# Altium schematic sheet Kajtuś-DSP_block_diagram.SchDoc: Kajtuś-DSP
size A4; DocumentNumber: 1; SheetNumber: 1; SheetTotal: 9
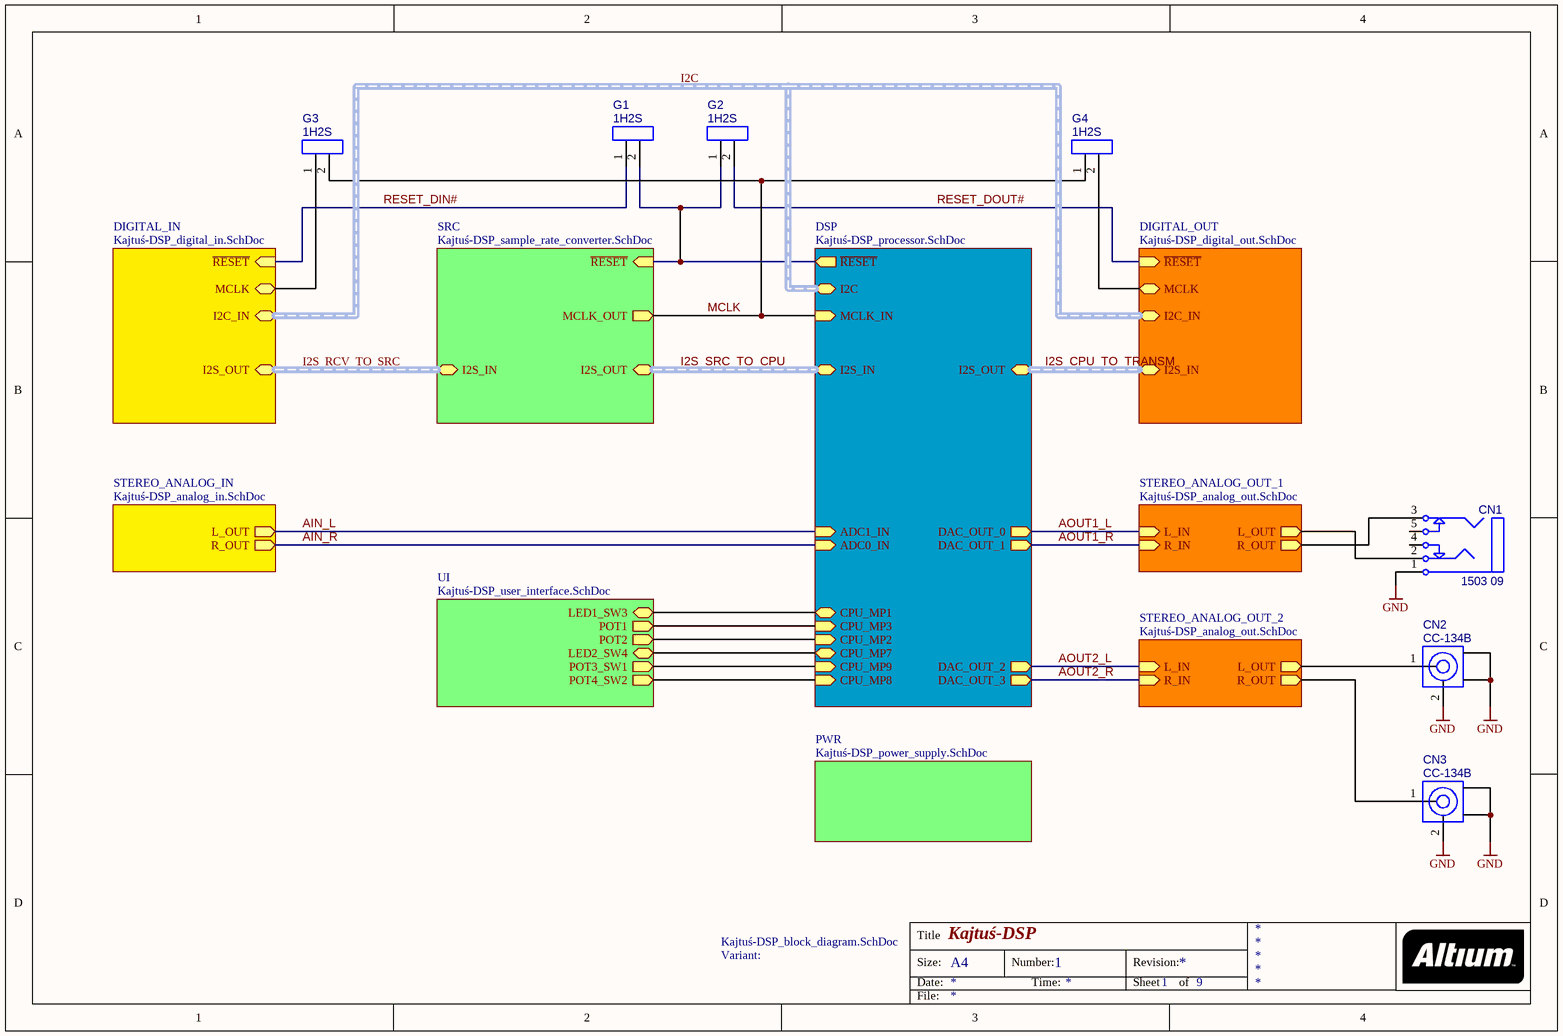
[diagram p0: Kajtuś-DSP_block_diagram.SchDoc]

## Parts
CN1  1503 09  [CN_JACK_3.5_STEREO_1503-09]
CN2  CC-134B  [CN_RCA_CC-134x]
CN3  CC-134B  [CN_RCA_CC-134x]
G1  value 1H2S  [1H2S_FHS]  (hidden comment: G_1H2S)
G2  value 1H2S  [1H2S_FHS]  (hidden comment: G_1H2S)
G3  value 1H2S  [1H2S_FHS]  (hidden comment: G_1H2S)
G4  value 1H2S  [1H2S_FHS]  (hidden comment: G_1H2S)

## Sub-sheets
DIGITAL_IN = Kajtuś-DSP_digital_in.SchDoc: ~{RESET} (in), I2S_OUT (harness I2S), I2C_IN (harness I2C), MCLK
DIGITAL_OUT = Kajtuś-DSP_digital_out.SchDoc: ~{RESET} (in), I2S_IN (harness I2S), I2C_IN (harness I2C), MCLK
DSP = Kajtuś-DSP_processor.SchDoc: I2S_IN (harness I2S), ~{RESET} (out), DAC_OUT_0 (out), DAC_OUT_1 (out), DAC_OUT_2 (out), DAC_OUT_3 (out), ADC0_IN (in), ADC1_IN (in), CPU_MP1, CPU_MP2 (in), CPU_MP3 (in), CPU_MP7, CPU_MP8 (in), CPU_MP9 (in), I2S_OUT (harness I2S), I2C (harness I2C), MCLK_IN (in)
PWR = Kajtuś-DSP_power_supply.SchDoc: no entries
SRC = Kajtuś-DSP_sample_rate_converter.SchDoc: I2S_IN (harness I2S), I2S_OUT (harness I2S), ~{RESET} (in), MCLK_OUT (out)
STEREO_ANALOG_IN = Kajtuś-DSP_analog_in.SchDoc: L_OUT (out), R_OUT (out)
STEREO_ANALOG_OUT_1 = Kajtuś-DSP_analog_out.SchDoc: L_IN (in), R_IN (in), L_OUT (out), R_OUT (out)
STEREO_ANALOG_OUT_2 = Kajtuś-DSP_analog_out.SchDoc: L_IN (in), R_IN (in), L_OUT (out), R_OUT (out)
UI = Kajtuś-DSP_user_interface.SchDoc: POT1 (out), POT2 (out), POT3_SW1 (out), POT4_SW2 (out), LED1_SW3, LED2_SW4

## Nets
GND: CN1.1 CN2.2 CN2.SH1 CN2.SH2 CN3.2 CN3.SH1 CN3.SH2
AIN_L: sheet DSP/ADC1_IN, sheet STEREO_ANALOG_IN/L_OUT
AIN_R: sheet DSP/ADC0_IN, sheet STEREO_ANALOG_IN/R_OUT
AOUT1_L: sheet DSP/DAC_OUT_0, sheet STEREO_ANALOG_OUT_1/L_IN
AOUT1_R: sheet DSP/DAC_OUT_1, sheet STEREO_ANALOG_OUT_1/R_IN
AOUT2_L: sheet DSP/DAC_OUT_2, sheet STEREO_ANALOG_OUT_2/L_IN
AOUT2_R: sheet DSP/DAC_OUT_3, sheet STEREO_ANALOG_OUT_2/R_IN
MCLK: G3.2 G4.1 ; sheet SRC/MCLK_OUT, sheet DSP/MCLK_IN
RESET_DIN#: G1.1 ; sheet DIGITAL_IN/~{RESET}
RESET_DOUT#: G2.2 ; sheet DIGITAL_OUT/~{RESET}
NetCN1_2: CN1.2 ; sheet STEREO_ANALOG_OUT_1/L_OUT
NetCN1_3: CN1.3 ; sheet STEREO_ANALOG_OUT_1/R_OUT
NetCN2_1: CN2.1 ; sheet STEREO_ANALOG_OUT_2/L_OUT
NetCN3_1: CN3.1 ; sheet STEREO_ANALOG_OUT_2/R_OUT
NetG1_2: G1.2 G2.1 ; sheet SRC/~{RESET}, sheet DSP/~{RESET}
NetG3_1: G3.1 ; sheet DIGITAL_IN/MCLK
NetG4_2: G4.2 ; sheet DIGITAL_OUT/MCLK
(unnamed): sheet DSP/CPU_MP1, sheet UI/LED1_SW3
(unnamed): sheet DSP/CPU_MP2, sheet UI/POT2
(unnamed): sheet DSP/CPU_MP3, sheet UI/POT1
(unnamed): sheet DSP/CPU_MP7, sheet UI/LED2_SW4
(unnamed): sheet DSP/CPU_MP8, sheet UI/POT4_SW2
(unnamed): sheet DSP/CPU_MP9, sheet UI/POT3_SW1

Not connected (* = marked no-connect by the designer): CN1 4 5

## Buses and harness runs
harness I2C = sheet DIGITAL_IN/I2C_IN = sheet DIGITAL_OUT/I2C_IN = sheet DSP/I2C
harness I2S_CPU_TO_TRANSM = sheet DIGITAL_OUT/I2S_IN = sheet DSP/I2S_OUT
harness I2S_RCV_TO_SRC = sheet DIGITAL_IN/I2S_OUT = sheet SRC/I2S_IN
harness I2S_SRC_TO_CPU = sheet DSP/I2S_IN = sheet SRC/I2S_OUT

## Notes on the sheet
- Variant:
- Title
- Size:
- Date:
- A4
- Number:
- Time:
- Revision:
- Sheet
- of
- File:

## Library data of the parts
CN1 = CN_JACK_3.5_STEREO_1503-09: 3-Conductor Jack with 2 break contacts (normals) and 2 auxiliary make contacts; Manufacturer: Lumberg; Vendor: TME; Part Number: 1503 09
CN2 CN3 = CN_RCA_CC-134B: Gniazdo RCA, żeńskie, ekranowane, kątowe 90°; do druku, THT, niklowane; Manufacturer: ??; Vendor: TME; Part Number: CN_RCA_CC-134B; Vendor Part Number: CC-134B; Manufacturer Part Number: CC-134B; Value: CC-134B
G1-G4 = G_1H2S: Listwa jednorzędowa, 1x2 piny, raster 2,54mm; Manufacturer: generic; Vendor: TME; Part Number: G_1H2S